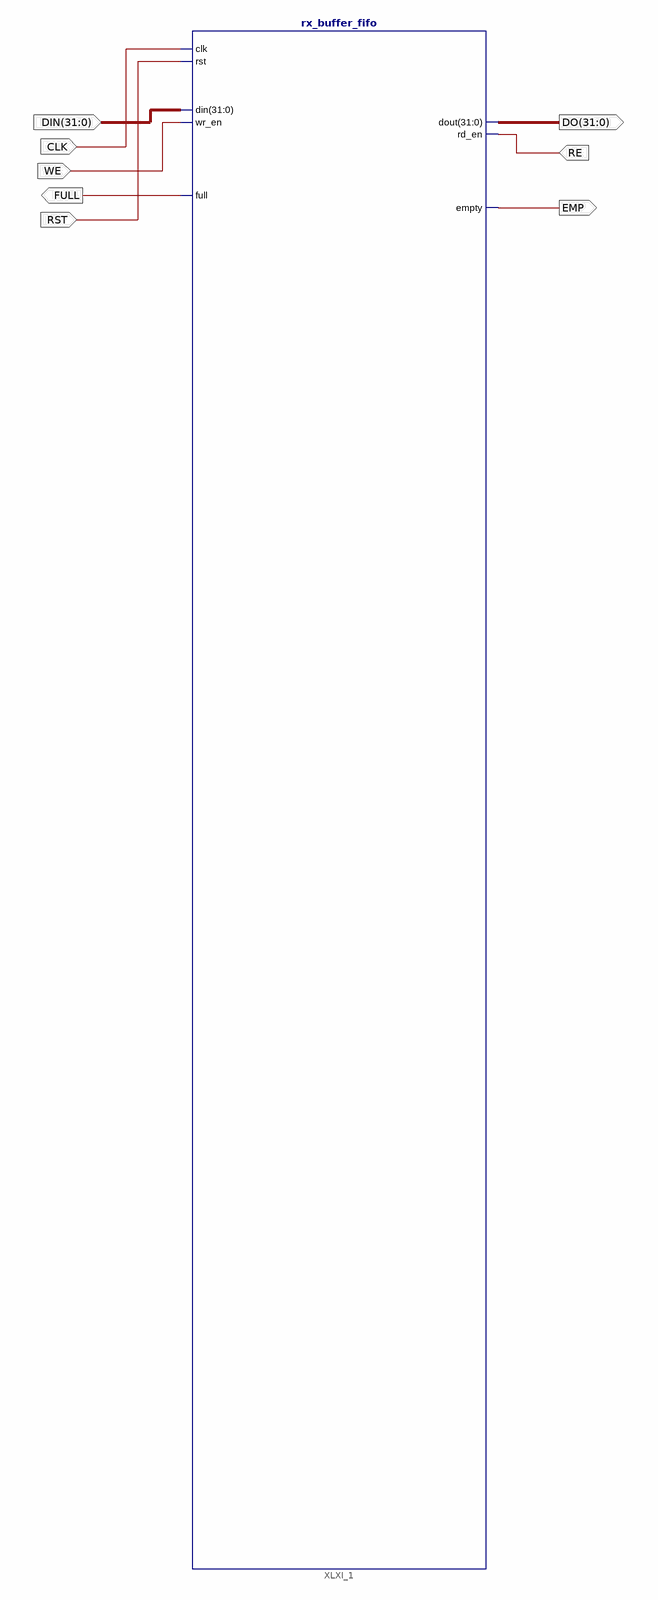
[diagram p0: schematic sheet 1]
// Xilinx ISE schematic rx_buffer_wrapper.sch (spartan6) as structural Verilog: 1 symbols, 8 ports
module rx_buffer_wrapper (
  input  CLK,
  input  RST,
  input  [31:0] DIN,
  input  WE,
  input  RE,
  output FULL,
  output [31:0] DO,
  output EMP
);

  rx_buffer_fifo XLXI_1 (.clk(CLK), .rst(RST), .din(DIN), .wr_en(WE), .full(FULL), .dout(DO), .rd_en(RE), .empty(EMP));
endmodule
